# Altium schematic sheet 03-Display.SchDoc
size A4
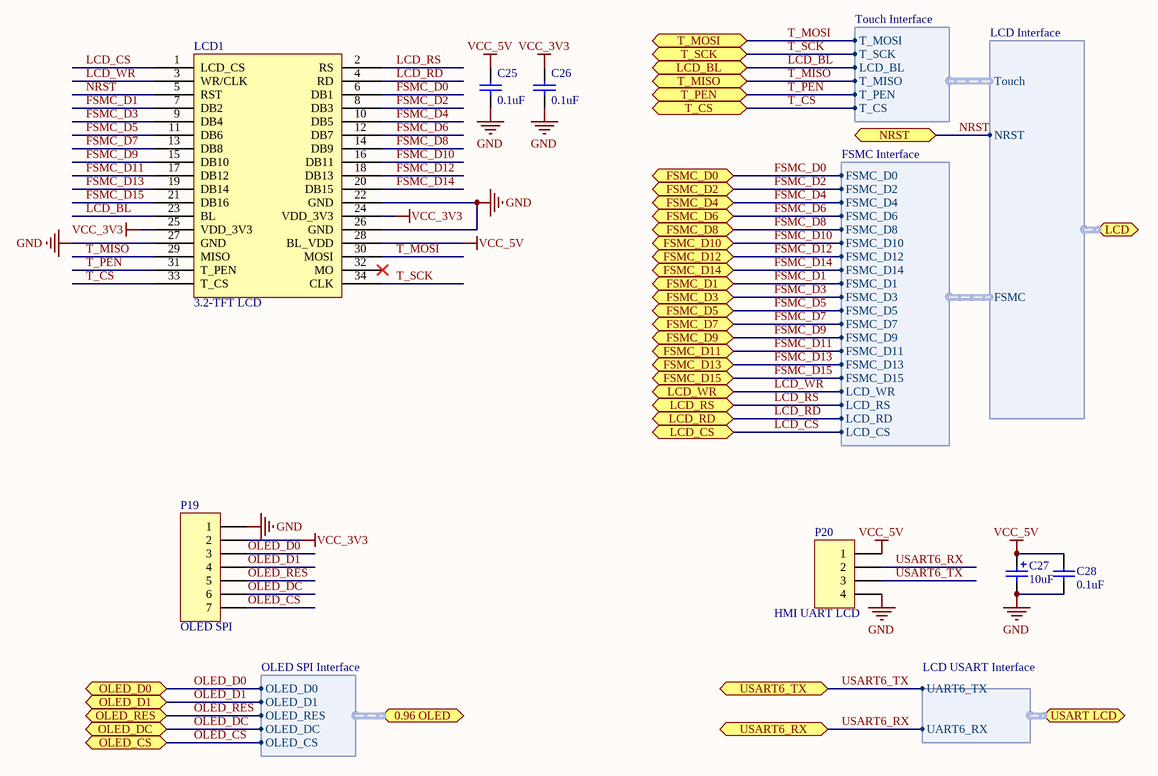
[diagram p0: 03-Display.SchDoc]

## Parts
C25  0.1uF  [0603C]
C26  0.1uF  [0603C]
C27  10uF  [1206T]
C28  0.1uF  [0603C]
LCD1  3.2-TFT LCD  [3.2_LCD]
P19  OLED SPI  [OLED_0.96_SPI]
P20  HMI UART LCD  [xh_4]

## Ports
0.96 OLED (bidir, harness OLED SPI Interface), FSMC_D0 (bidir), FSMC_D1 (bidir), FSMC_D2 (bidir), FSMC_D3 (bidir), FSMC_D4 (bidir), FSMC_D5 (bidir), FSMC_D6 (bidir), FSMC_D7 (bidir), FSMC_D8 (bidir), FSMC_D9 (bidir), FSMC_D10 (bidir), FSMC_D11 (bidir), FSMC_D12 (bidir), FSMC_D13 (bidir), FSMC_D14 (bidir), FSMC_D15 (bidir), LCD (bidir, harness LCD Interface), LCD_BL (bidir), LCD_CS (bidir), LCD_RD (bidir), LCD_RS (bidir), LCD_WR (bidir), NRST (bidir), OLED_CS (bidir), OLED_D0 (bidir), OLED_D1 (bidir), OLED_DC (bidir), OLED_RES (bidir), T_CS (bidir), T_MISO (bidir), T_MOSI (bidir), T_PEN (bidir), T_SCK (bidir), USART6_RX (bidir), USART6_TX (bidir), USART LCD (bidir, harness LCD USART Interface)

## Harnesses
LCD Interface: NRST, Touch, FSMC
Touch Interface: T_MOSI, T_SCK, LCD_BL, T_MISO, T_PEN, T_CS
FSMC Interface: FSMC_D0, FSMC_D2, FSMC_D4, FSMC_D6, FSMC_D8, FSMC_D10, FSMC_D12, FSMC_D14, FSMC_D1, FSMC_D3, FSMC_D5, FSMC_D7, FSMC_D9, FSMC_D11, FSMC_D13, FSMC_D15, LCD_WR, LCD_RS, LCD_RD, LCD_CS
OLED SPI Interface: OLED_D0, OLED_D1, OLED_RES, OLED_DC, OLED_CS
LCD USART Interface: UART6_TX, UART6_RX

## Nets
GND: C25.2 C26.2 C27.2(-) C28.1 LCD1.22(GND) LCD1.26(GND) LCD1.27(GND) P19.1 P20.4
VCC_3V3: C26.1 LCD1.24(VDD_3V3) LCD1.25(VDD_3V3) P19.2
VCC_5V: C25.1 C27.1(+) C28.2 LCD1.28(BL_VDD) P20.1
FSMC_D0: LCD1.6(DB1) ; port FSMC_D0, harness FSMC Interface.FSMC_D0
FSMC_D1: LCD1.7(DB2) ; port FSMC_D1, harness FSMC Interface.FSMC_D1
FSMC_D2: LCD1.8(DB3) ; port FSMC_D2, harness FSMC Interface.FSMC_D2
FSMC_D3: LCD1.9(DB4) ; port FSMC_D3, harness FSMC Interface.FSMC_D3
FSMC_D4: LCD1.10(DB5) ; port FSMC_D4, harness FSMC Interface.FSMC_D4
FSMC_D5: LCD1.11(DB6) ; port FSMC_D5, harness FSMC Interface.FSMC_D5
FSMC_D6: LCD1.12(DB7) ; port FSMC_D6, harness FSMC Interface.FSMC_D6
FSMC_D7: LCD1.13(DB8) ; port FSMC_D7, harness FSMC Interface.FSMC_D7
FSMC_D8: LCD1.14(DB9) ; port FSMC_D8, harness FSMC Interface.FSMC_D8
FSMC_D9: LCD1.15(DB10) ; port FSMC_D9, harness FSMC Interface.FSMC_D9
FSMC_D10: LCD1.16(DB11) ; port FSMC_D10, harness FSMC Interface.FSMC_D10
FSMC_D11: LCD1.17(DB12) ; port FSMC_D11, harness FSMC Interface.FSMC_D11
FSMC_D12: LCD1.18(DB13) ; port FSMC_D12, harness FSMC Interface.FSMC_D12
FSMC_D13: LCD1.19(DB14) ; port FSMC_D13, harness FSMC Interface.FSMC_D13
FSMC_D14: LCD1.20(DB15) ; port FSMC_D14, harness FSMC Interface.FSMC_D14
FSMC_D15: LCD1.21(DB16) ; port FSMC_D15, harness FSMC Interface.FSMC_D15
LCD_BL: LCD1.23(BL) ; port LCD_BL, harness Touch Interface.LCD_BL
LCD_CS: LCD1.1(LCD_CS) ; port LCD_CS, harness FSMC Interface.LCD_CS
LCD_RD: LCD1.4(RD) ; port LCD_RD, harness FSMC Interface.LCD_RD
LCD_RS: LCD1.2(RS) ; port LCD_RS, harness FSMC Interface.LCD_RS
LCD_WR: LCD1.3(WR/CLK) ; port LCD_WR, harness FSMC Interface.LCD_WR
NRST: LCD1.5(RST) ; port NRST, port LCD.NRST
OLED_CS: P19.7 ; port OLED_CS, port 0.96 OLED.OLED_CS
OLED_D0: P19.3 ; port OLED_D0, port 0.96 OLED.OLED_D0
OLED_D1: P19.4 ; port OLED_D1, port 0.96 OLED.OLED_D1
OLED_DC: P19.6 ; port OLED_DC, port 0.96 OLED.OLED_DC
OLED_RES: P19.5 ; port OLED_RES, port 0.96 OLED.OLED_RES
T_CS: LCD1.33(T_CS) ; port T_CS, harness Touch Interface.T_CS
T_MISO: LCD1.29(MISO) ; port T_MISO, harness Touch Interface.T_MISO
T_MOSI: LCD1.30(MOSI) ; port T_MOSI, harness Touch Interface.T_MOSI
T_PEN: LCD1.31(T_PEN) ; port T_PEN, harness Touch Interface.T_PEN
T_SCK: LCD1.34(CLK) ; port T_SCK, harness Touch Interface.T_SCK
USART6_RX: P20.2 ; port USART6_RX, port USART LCD.UART6_RX
USART6_TX: P20.3 ; port USART6_TX, port USART LCD.UART6_TX

Not connected (* = marked no-connect by the designer): LCD1 32(MO)*

## Library data of the parts
C25 C26 C28 = Cap1: CAP CER 10000PF 100V X7R 0603; Manufacturer: TDK Corporation; Manufacturer Part Number: C1608X7R2A103K080AA; Tolerance: ±10%; Notification: Current market demand for these product types have resulted in fluctuating and extending lead times. Lead times may differ.; Supplier 1: Digi-Key; RoHS: RoHS Compliant; Category: Capacitors; Stock 1: 40000; Pricing 1: 4000=0.01438 (USD); Packaging: Tape & Reel (TR); Part Status: Active; Voltage - Rated: 100V; Temperature Coefficient: X7R; Operating Temperature: -55°C ~ 125°C; Features: -; Ratings: -; Applications: General Purpose; Failure Rate: -; Mounting Type: Surface Mount, MLCC; Package / Case: 0603 (1608 Metric); Size / Dimension: 0.063" L x 0.032" W (1.60mm x 0.80mm); Height - Seated (Max): -; Thickness (Max): 0.035" (0.90mm); Lead Spacing: -; Lead Style: -; ComponentLink1URL: https://product.tdk.com/info/en/catalog/datasheets/mlcc_commercial_midvoltage_en.pdf; ComponentLink1Description: https://product.tdk.com/info/en/catalog/datasheets/mlcc_commercial_midvoltage_en.pdf; Supplier Part Number 1: 445-1304-2-ND; Value: 0.1uF
C27 = Cap2: CAP TANT 10UF 10V 10% 1206; Manufacturer: KEMET; Manufacturer Part Number: T491A106K010AT7280; Manufacturer Size Code: A; Type: Molded; ESR (Equivalent Series Resistance): 3.8 Ohm; Lifetime @ Temp.: 2000 Hrs @ 125°C; Notification: Current market demand for these product types have resulted in fluctuating and extending lead times. Lead times may differ.; Supplier 1: Digi-Key; RoHS: RoHS Compliant; Category: Capacitors; Stock 1: 27000; Pricing 1: 9000=0.084, 18000=0.08138, 27000=0.07875, 63000=0.0735 (USD); Packaging: Tape & Reel (TR); Part Status: Active; Tolerance: ±10%; Operating Temperature: -55°C ~ 125°C; Mounting Type: Surface Mount; Package / Case: 1206 (3216 Metric); Size / Dimension: 0.126" L x 0.063" W (3.20mm x 1.60mm); Height - Seated (Max): 0.071" (1.80mm); Lead Spacing: -; Features: General Purpose; Failure Rate: -; ComponentLink1URL: https://api.kemet.com/component-edge/download/datasheet/T491A106K010AT7280.pdf; ComponentLink1Description: https://api.kemet.com/component-edge/download/datasheet/T491A106K010AT7280.pdf; Supplier Part Number 1: 399-8268-2-ND; Value: 10uF
P19 = Header 7: Header, 7-Pin; LatestRevisionDate: 17-Jul-2002; LatestRevisionNote: Re-released for DXP Platform.; Publisher: Altium Limited
P20 = Header 4: Header, 4-Pin; LatestRevisionDate: 17-Jul-2002; LatestRevisionNote: Re-released for DXP Platform.; Publisher: Altium Limited